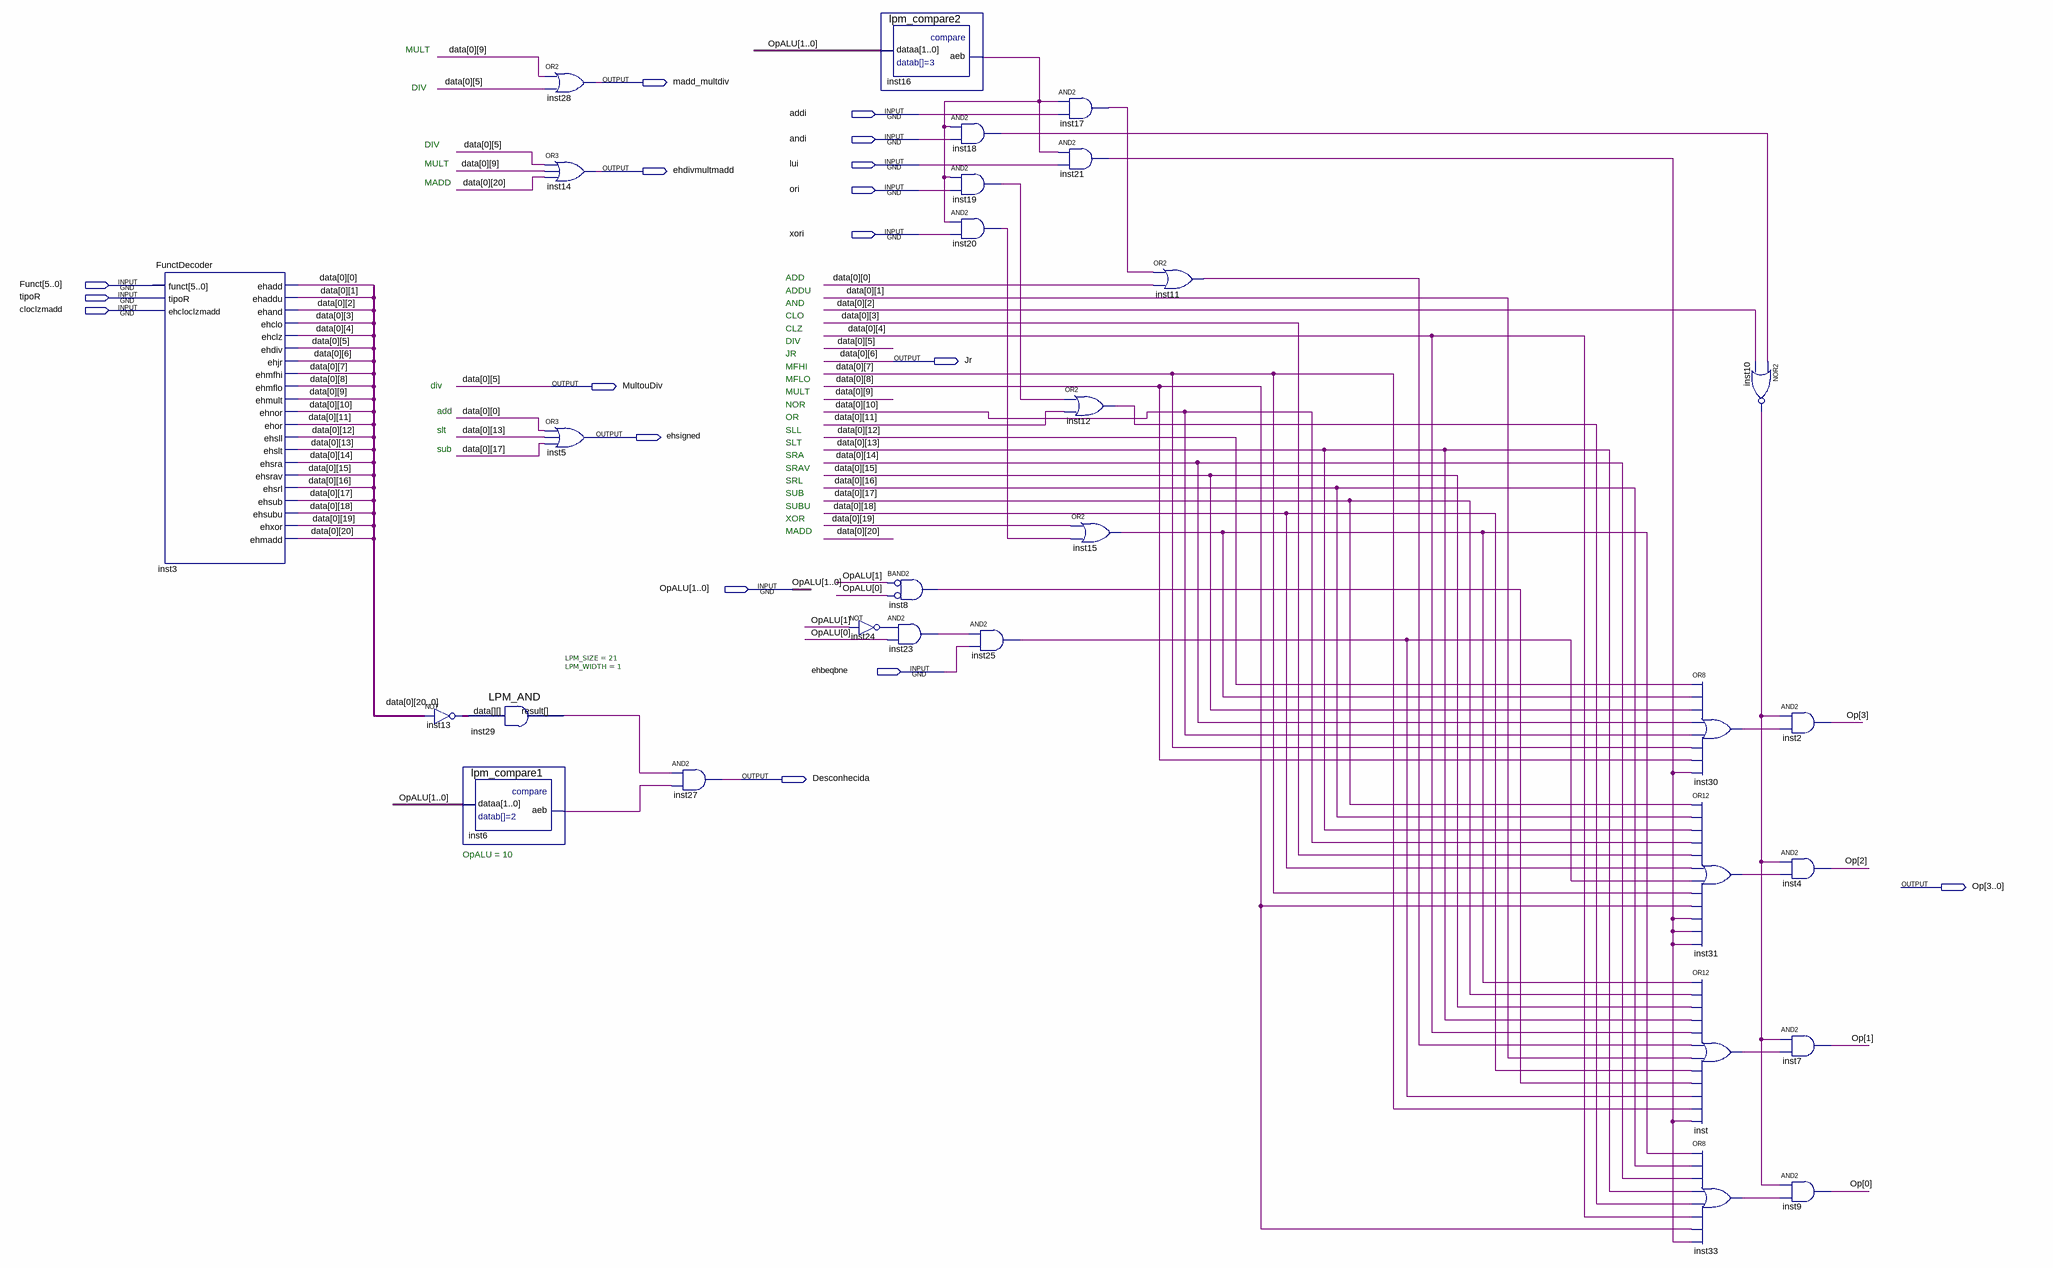
[diagram p0: schematic sheet]
// Quartus schematic ControleULA.bdf as structural Verilog: 30 symbols, 17 pins
module ControleULA (
  input  addi,
  input  andi,
  input  lui,
  input  ori,
  input  xori,
  input  [5:0] Funct,
  input  tipoR,
  input  cloclzmadd,
  input  [1:0] OpALU,
  input  ehbeqbne,
  output madd_multdiv,
  output ehdivmultmadd,
  output Jr,
  output MultouDiv,
  output ehsigned,
  output Desconhecida,
  output [3:0] Op
);

  wire inst6_aeb, inst8_out, inst10_out, inst11_out, inst12_out, inst15_out, inst16_aeb, inst17_out,
       inst18_out, inst19_out, inst20_out, inst21_out, inst23_out, inst24_out, inst25_out, inst29_result,
       inst30_out, inst31_out, inst33_out, inst_out;
  wire [20:0] data_0, inst13_out;

  FunctDecoder inst3 (
    .funct(Funct), .tipoR(tipoR), .ehcloclzmadd(cloclzmadd), .ehadd(data_0[0]), .ehaddu(data_0[1]),
    .ehand(data_0[2]), .ehclo(data_0[3]), .ehclz(data_0[4]), .ehdiv(MultouDiv), .ehjr(Jr),
    .ehmfhi(data_0[7]), .ehmflo(data_0[8]), .ehmult(data_0[9]), .ehnor(data_0[10]), .ehor(data_0[11]),
    .ehsll(data_0[12]), .ehslt(data_0[13]), .ehsra(data_0[14]), .ehsrav(data_0[15]), .ehsrl(data_0[16]),
    .ehsub(data_0[17]), .ehsubu(data_0[18]), .ehxor(data_0[19]), .ehmadd(data_0[20]));
  LPM_AND #(.LPM_SIZE(21), .LPM_WIDTH(1)) inst29 (.data(inst13_out), .result(inst29_result));
  assign inst13_out = ~{data_0[20:7], Jr, MultouDiv, data_0[4:0]};  // NOT inst13, 21 bits wide
  lpm_compare1 inst6 (.dataa(OpALU), .aeb(inst6_aeb));
  or inst28 (madd_multdiv, data_0[9], MultouDiv);
  or inst14 (ehdivmultmadd, MultouDiv, data_0[9], data_0[20]);
  or inst5 (ehsigned, data_0[0], data_0[13], data_0[17]);
  and inst27 (Desconhecida, inst29_result, inst6_aeb);
  not inst24 (inst24_out, OpALU[1]);
  lpm_compare2 inst16 (.dataa(OpALU), .aeb(inst16_aeb));
  and inst8 (inst8_out, ~OpALU[1], ~OpALU[0]);  // BAND2
  and inst23 (inst23_out, inst24_out, OpALU[0]);
  and inst18 (inst18_out, inst16_aeb, andi);
  and inst19 (inst19_out, inst16_aeb, ori);
  and inst20 (inst20_out, inst16_aeb, xori);
  and inst25 (inst25_out, inst23_out, ehbeqbne);
  and inst17 (inst17_out, inst16_aeb, addi);
  and inst21 (inst21_out, inst16_aeb, lui);
  or inst12 (inst12_out, inst19_out, data_0[11]);
  or inst15 (inst15_out, data_0[19], inst20_out);
  or inst11 (inst11_out, inst17_out, data_0[0]);
  or inst30 (inst30_out, data_0[12], inst15_out, data_0[15], data_0[14], data_0[10], data_0[7], data_0[8], inst21_out);
  or inst31 (inst31_out, data_0[17], data_0[16], data_0[13], data_0[10], data_0[3], data_0[18], inst25_out, data_0[7], data_0[8], inst21_out, inst21_out, inst21_out);
  or inst (inst_out, inst15_out, data_0[17], data_0[15], data_0[13], data_0[4], inst11_out, data_0[1], data_0[18], inst8_out, inst25_out, data_0[7], inst21_out);
  or inst33 (inst33_out, inst15_out, data_0[16], data_0[14], data_0[13], inst12_out, data_0[4], data_0[8], inst21_out);
  nor inst10 (inst10_out, inst18_out, data_0[2]);
  and inst2 (Op[3], inst10_out, inst30_out);
  and inst4 (Op[2], inst10_out, inst31_out);
  and inst7 (Op[1], inst10_out, inst_out);
  and inst9 (Op[0], inst10_out, inst33_out);

  // Other names for the same wires on the sheet: data_0[6:5] = {Jr, MultouDiv}

  // Notes on the sheet:
  //   MULT
  //   DIV
  //   DIV
  //   MULT
  //   MADD
  //   ADD
  //   ADDU
  //   AND
  //   CLO
  //   CLZ
  //   DIV
  //   JR
  //   MFHI
  //   MFLO
  //   div
  //   MULT
  //   NOR
  //   add
  //   OR
  //   slt
  //   SLL
  //   SLT
  //   sub
  //   SRA
  //   SRAV
  //   SRL
  //   SUB
  //   SUBU
  //   XOR
  //   MADD
  //   OpALU = 10
endmodule
